# EAGLE design fdc6326l_breakout (EAGLE 6.5.0)
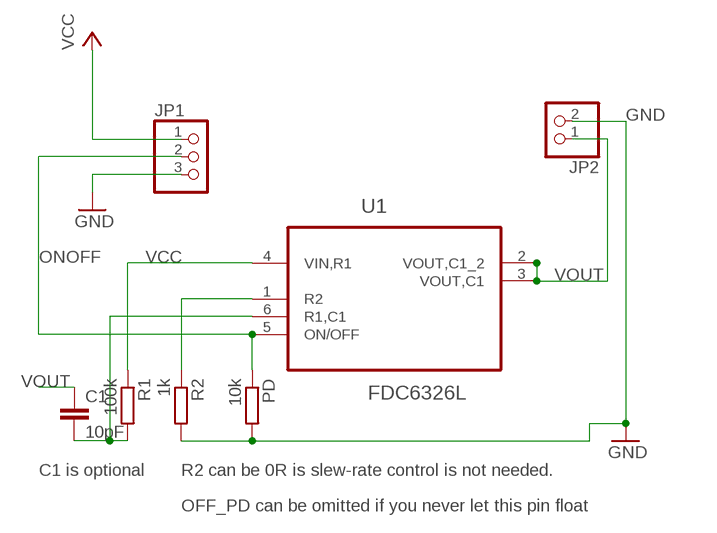
[diagram p0: schematic, sheet 1]

## Parts
C1  10pF  C-EUC0603  [C0603]
JP1  PINHD-1X3  [1X03]
JP2  PINHD-1X2  [1X02]
PD  10k  R-EU_R0603  [R0603]
R1  100k  R-EU_R0603  [R0603]
R2  1k  R-EU_R0603  [R0603]
U1  FDC6326L  [SOT95P280X110-6N]

## Nets
C1_R1: C1.2 R1.2 U1.6(R1,C1)
GND: JP1.3 JP2.2 PD.2 R2.2
ONOFF: JP1.2 PD.1 U1.5(ON/OFF)
R2: R2.1 U1.1(R2)
VCC: JP1.1 R1.1 U1.4(VIN,R1)
VOUT: C1.1 JP2.1 U1.2(VOUT,C1_2) U1.3(VOUT,C1)

## Notes on the sheet
- C1 is optional | R2 can be 0R is slew-rate control is not needed.
- OFF_PD can be omitted if you never let this pin float

## Library data of the parts
C1 = rcl:C-EU: CAPACITOR, European symbol
JP1 = pinhead:PINHD-1X3: PIN HEADER
JP2 = pinhead:PINHD-1X2: PIN HEADER
PD R1 R2 = rcl:R-EU_: RESISTOR, European symbol
U1 = Fairchild_By_element14_Batch_1:FDC6326L: Integrated Load Switch; MPN: FDC6326L; OC_FARNELL: 1706325; OC_NEWARK: 58K1423; PACKAGE: SSOT-23-6; SUPPLIER: FAIRCHILD SEMICONDUCTOR

## Board
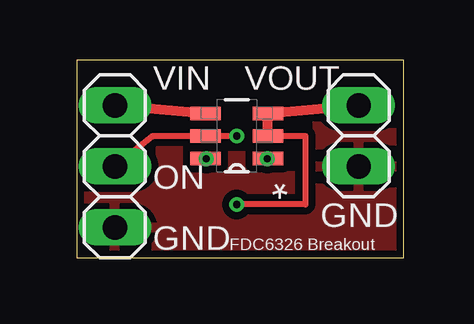
[diagram p1: board, top side]
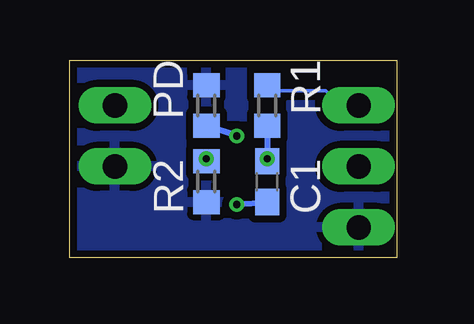
[diagram p2: board, bottom side, seen from below]

Size 13.63 x 8.24 mm. Coordinates in mm from the lower left corner, seen from the top.
Outline: 0,0 13.63,0 13.63,8.24 0,8.24 0,0
Copper layers (1*2*15*16): Top 0.035mm / dielectric 0.2mm / Route2 0.0175mm / dielectric 1.1mm / Route15 0.0175mm / dielectric 0.2mm / Bottom 0.035mm
Design rules "SeeedStudio_DRU_no_angle_20130527": minimum track width 6mil, minimum drill 12mil, track to track 6mil, track to pad 6mil, pad to pad 6mil, via to via 6mil, smd to smd 0mil, copper to edge 10mil, drill to drill 10mil, minimum pad ring 6mil, minimum via ring 6mil, stop-mask expansion 2mil, vias tented up to drill 25mil, thermal gap 10mil

### Footprints (pad centres in the part's own frame; a part is rotated, then mirrored left to right if it is on the bottom)
C0603 = smd 1.1 x 1: 1 -0.85,0; 2 0.85,0
1X03 = drill 1.016 long: 1 -2.54,0; 2 0,0; 3 2.54,0
1X02 = drill 1.016 long: 1 -1.27,0; 2 1.27,0
R0603 = smd 1 x 1.1: 1 -0.85,0; 2 0.85,0
SOT95P280X110-6N = smd 1.27 x 0.559: 1 -1.295,0.94; 2 -1.295,0; 3 -1.295,-0.94; 4 1.295,-0.94; 5 1.295,0; 6 1.295,0.94

### Placement (x,y rotation side)
C1  5.4,3.17 90 bottom
JP1  1.59,3.81 270 top
JP2  11.75,5.08 270 top
PD  7.94,6.35 90 bottom
R1  5.4,6.35 270 bottom
R2  7.94,3.17 270 bottom
U1  6.67,5.08 180 top

### Tracks (layer width: path | path; a pad name or v marks a point on that pad's centre or on a via)
C1_R1  (via drill 0.3)
  Top 0.152: v5.4,4.13 5.4,4.12 U1.6
  Bottom 0.254: R1.2 v5.4,4.13 C1.2
GND
  pour Bottom (isolate 0.305): 0,8.26 0,0 13.65,0 13.65,8.26
  pour Top (isolate 0.305): 0,8.26 0,0 13.65,0 13.65,8.26
ONOFF  (via drill 0.3)
  Top 0.254: JP1.2 3.17,5.08 U1.5 v6.67,5.08
  Bottom 0.254: v6.67,5.08 PD.1
R2  (via drill 0.3)
  Top 0.152: v7.94,4.13 7.94,4.12 U1.1
  Bottom 0.152: v7.94,4.13 R2.1
VCC
  Top 0.406: JP1.1 U1.4
  Bottom 0.152: JP1.1 2.35,6.35 2.96,6.96 5.19,6.96 5.4,7.16 R1.1
VOUT  (via drill 0.3)
  Top 0.254: U1.2 9.53,5.08 9.53,2.22 v6.67,2.22
  Top 0.406: U1.2 U1.3 JP2.1
  Bottom 0.254: v6.67,2.22 C1.1

### Text on the board
tNames: VIN | VOUT | ON | GND | GND | FDC6326 Breakout
bNames: R1 | PD | C1 | R2